# Altium project Modbus-HUB.PrjPcb (part 1 of 3)
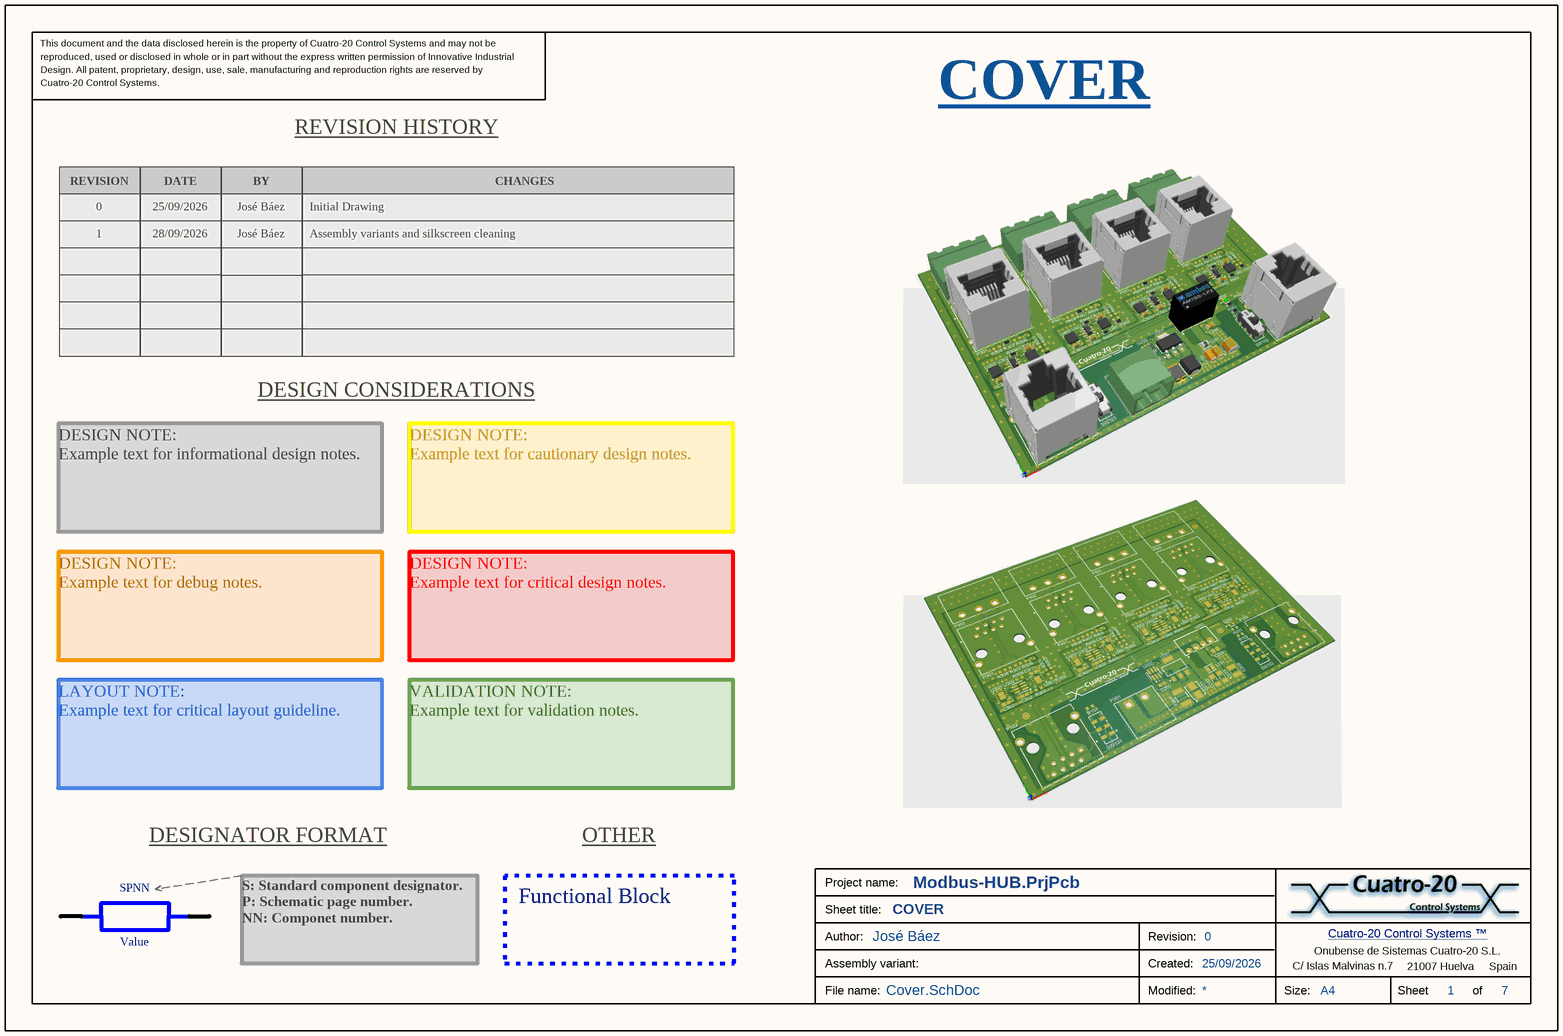
[diagram p0: Cover.SchDoc]
3 sheets, 19 parts. Net scope: hierarchical (ports join the sheet entries above them; power ports are global).
Board file: Modbus HUB.PcbDoc
Sheets:
  Cover.SchDoc
  Block diagram.SchDoc
    Supply = PSU.SchDoc

## Sheet Cover.SchDoc: COVER
size A4; Author: José Báez; CompanyName: Onubense de Sistemas Cuatro-20 S.L.; DrawnBy: José Báez; Address1: C/ Islas Malvinas n.7; Address2: 21007 Huelva; Address3: Spain; DocumentNumber: 1; Revision: 0; SheetNumber: 1; SheetTotal: 7; CreatedDate: 25/09/2026

### Parts
RT?  RevisionTable  (value not drawn)  (graphical)

### Notes on the sheet
- (near RT?) 0
- 1
- 28/09/2026
- José Báez
- Initial Drawing
- Assembly variants and silkscreen cleaning
- DESIGN CONSIDERATIONS
- DESIGN NOTE:
  Example text for informational design notes.
- DESIGN NOTE:
  Example text for cautionary design notes.
- DESIGN NOTE:
  Example text for debug notes.
- DESIGN NOTE:
  Example text for critical design notes.
- LAYOUT NOTE:
  Example text for critical layout guideline.
- VALIDATION NOTE:
  Example text for validation notes.
- DESIGNATOR FORMAT
- OTHER
- SPNN
- Functional Block
- Value
- S: Standard component designator.
  P: Schematic page number.
  NN: Componet number.
- This document and the data disclosed herein is the property of Cuatro-20 Control Systems and may not be
- reproduced, used or disclosed in whole or in part without the express written permission of Innovative Industrial
- Design. All patent, proprietary, design, use, sale, manufacturing and reproduction rights are reserved by
- Cuatro-20 Control Systems.
- Project name:
- Sheet title:
- File name:
- Assembly variant:
- Author:
- Modified:
- Created:
- Revision:
- Size:
- A4
- Sheet
- Cuatro-20 Control Systems ™ <www.cuatro-20.com>
- of
- (in symbol RevisionTable) REVISION HISTORY; REVISION; DATE; BY; CHANGES

## Sheet Block diagram.SchDoc: BLOCK DIAGRAM
size A4; ApprovedBy: José Báez; CheckedBy: José Báez; Author: José Báez; CompanyName: Onubense de Sistemas Cuatro-20 S.L.; DrawnBy: José Báez; Engineer: José Báez; Organization: Cuatro-20 Control Systems; Address1: C/ Islas Malvinas n.7; Address2: 21007 Huelva; Address3: Spain; DocumentNumber: 2; Revision: 0; SheetNumber: 2; SheetTotal: 7; CreatedDate: 25/09/2026
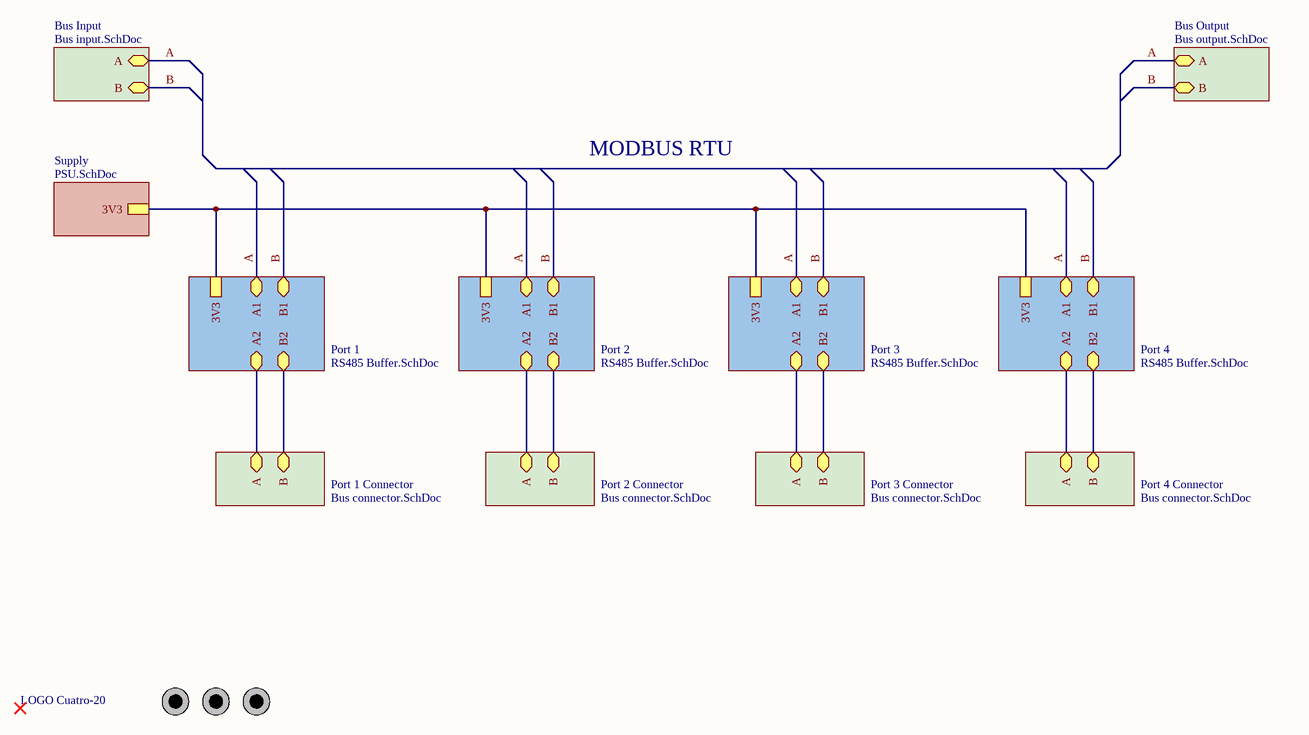
[diagram p1: Block diagram.SchDoc]

### Parts
FD1  Fiducial  [Fiducial 2mm]  (value not drawn)
FD2  Fiducial  [Fiducial 2mm]  (value not drawn)
FD3  Fiducial  [Fiducial 2mm]  (value not drawn)
Logo1  Cuatro-20  [Logo Cuatro-20]  (value not drawn)

### Sub-sheets
Bus Input = Bus input.SchDoc (file not in this document): A (bidir), B (bidir)
Bus Output = Bus output.SchDoc (file not in this document): A (bidir), B (bidir)
Port 1 = RS485 Buffer.SchDoc (file not in this document): 3V3, A1 (bidir), B1 (bidir), A2 (bidir), B2 (bidir)
Port 1 Connector = Bus connector.SchDoc (file not in this document): A (bidir), B (bidir)
Port 2 = RS485 Buffer.SchDoc (file not in this document): 3V3, A1 (bidir), B1 (bidir), A2 (bidir), B2 (bidir)
Port 2 Connector = Bus connector.SchDoc (file not in this document): A (bidir), B (bidir)
Port 3 = RS485 Buffer.SchDoc (file not in this document): 3V3, A1 (bidir), B1 (bidir), A2 (bidir), B2 (bidir)
Port 3 Connector = Bus connector.SchDoc (file not in this document): A (bidir), B (bidir)
Port 4 = RS485 Buffer.SchDoc (file not in this document): 3V3, A1 (bidir), B1 (bidir), A2 (bidir), B2 (bidir)
Port 4 Connector = Bus connector.SchDoc (file not in this document): A (bidir), B (bidir)
Supply = PSU.SchDoc: 3V3

### Nets
3V3: sheet Supply/3V3, sheet Port 1/3V3, sheet Port 2/3V3, sheet Port 3/3V3, sheet Port 4/3V3
A: sheet Port 1/A1, sheet Port 2/A1, sheet Port 3/A1, sheet Port 4/A1, sheet Bus Input/A, sheet Bus Output/A
B: sheet Port 1/B1, sheet Port 2/B1, sheet Port 3/B1, sheet Port 4/B1, sheet Bus Input/B, sheet Bus Output/B
(unnamed): sheet Port 1/A2, sheet Port 1 Connector/A
(unnamed): sheet Port 1/B2, sheet Port 1 Connector/B
(unnamed): sheet Port 2/A2, sheet Port 2 Connector/A
(unnamed): sheet Port 2/B2, sheet Port 2 Connector/B
(unnamed): sheet Port 3/A2, sheet Port 3 Connector/A
(unnamed): sheet Port 3/B2, sheet Port 3 Connector/B
(unnamed): sheet Port 4/A2, sheet Port 4 Connector/A
(unnamed): sheet Port 4/B2, sheet Port 4 Connector/B

### Notes on the sheet
- MODBUS RTU
- This document and the data disclosed herein is the property of Cuatro-20 Control Systems and may not be
- reproduced, used or disclosed in whole or in part without the express written permission of Innovative Industrial
- Design. All patent, proprietary, design, use, sale, manufacturing and reproduction rights are reserved by
- Cuatro-20 Control Systems.
- Project name:
- Sheet title:
- File name:
- Assembly variant:
- Author:
- Modified:
- Created:
- Revision:
- Size:
- A4
- Sheet
- Cuatro-20 Control Systems ™ <www.cuatro-20.com>
- of
- (in symbol Cuatro-20) LOGO Cuatro-20

### Library data of the parts
FD1-FD3 = Fiducial: Fiducial Mark
Logo1 = Cuatro-20: Cuatro-20 Logo

## Sheet PSU.SchDoc: POWER SUPPLY
size A4; ApprovedBy: José Báez; CheckedBy: José Báez; Author: José Báez; CompanyName: Onubense de Sistemas Cuatro-20 S.L.; DrawnBy: José Báez; Engineer: José Báez; Organization: Cuatro-20 Control Systems; Address1: C/ Islas Malvinas n.7; Address2: 21007 Huelva; Address3: Spain; DocumentNumber: 3; Revision: 0; SheetNumber: 4; SheetTotal: 7; CreatedDate: 25/09/2026
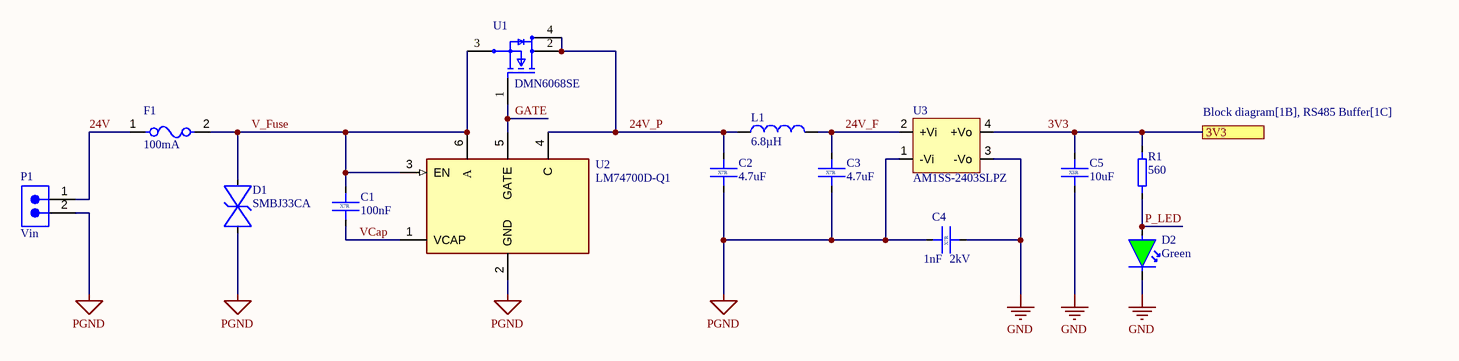
[diagram p2: PSU.SchDoc]

### Parts
C1  100nF  Dielectric: X7R  [C0603-DC]
C2  4.7uF  Dielectric: X7R  [C1206-FB]
C3  4.7uF  Dielectric: X7R  [C1206-FB]
C4  1nF  Voltage: 2kV  Dielectric: X7R  [C1210-GB]
C5  10uF  Dielectric: X5R  [C0805-EA]
D1  SMBJ33CA  [SMB]
D2  Green  [LED 0603 Green]
F1  100mA  [FP-MF-MSMF010-MFG]
L1  6.8µH  [L0806-Murata]
P1  Vin  [691313510002]
R1  560  [RC0603]
U1  DMN6068SE  [SOT223]
U2  LM74700D-Q1  [SOT23-6-TI]
U3  AM1SS-2403SLPZ  [AM1SS-LPZ]

### Ports
3V3 (see Block diagram[1B], RS485 Buffer[1C])

### Nets
GND: C4.2 C5.2 D2.1(C) U3.3(-Vo)
PGND: C2.2 C3.2 C4.1 D1.1(C) P1.2 U2.2(GND) U3.1(-Vi)
3V3: C5.1 R1.2 U3.4(+Vo) ; port 3V3
24V: F1.1 P1.1
24V_F: C3.1 L1.2 U3.2(+Vi)
24V_P: C2.1 L1.1 U1.2(D) U1.4(D) U2.4(C)
GATE: U1.1(G) U2.5(GATE)
P_LED: D2.2(A) R1.1
V_Fuse: C1.1 D1.2(A) F1.2 U1.3(S) U2.3(EN) U2.6(A)
VCap: C1.2 U2.1(VCAP)

### Notes on the sheet
- This document and the data disclosed herein is the property of Cuatro-20 Control Systems and may not be
- reproduced, used or disclosed in whole or in part without the express written permission of Innovative Industrial
- Design. All patent, proprietary, design, use, sale, manufacturing and reproduction rights are reserved by
- Cuatro-20 Control Systems.
- Project name:
- Sheet title:
- File name:
- Assembly variant:
- Author:
- Modified:
- Created:
- Revision:
- Size:
- A4
- Sheet
- Cuatro-20 Control Systems ™ <www.cuatro-20.com>
- of